# Altium schematic sheet ADC_DRIVER.SchDoc
size Tabloid; SheetNumber: 4; SheetTotal: 5
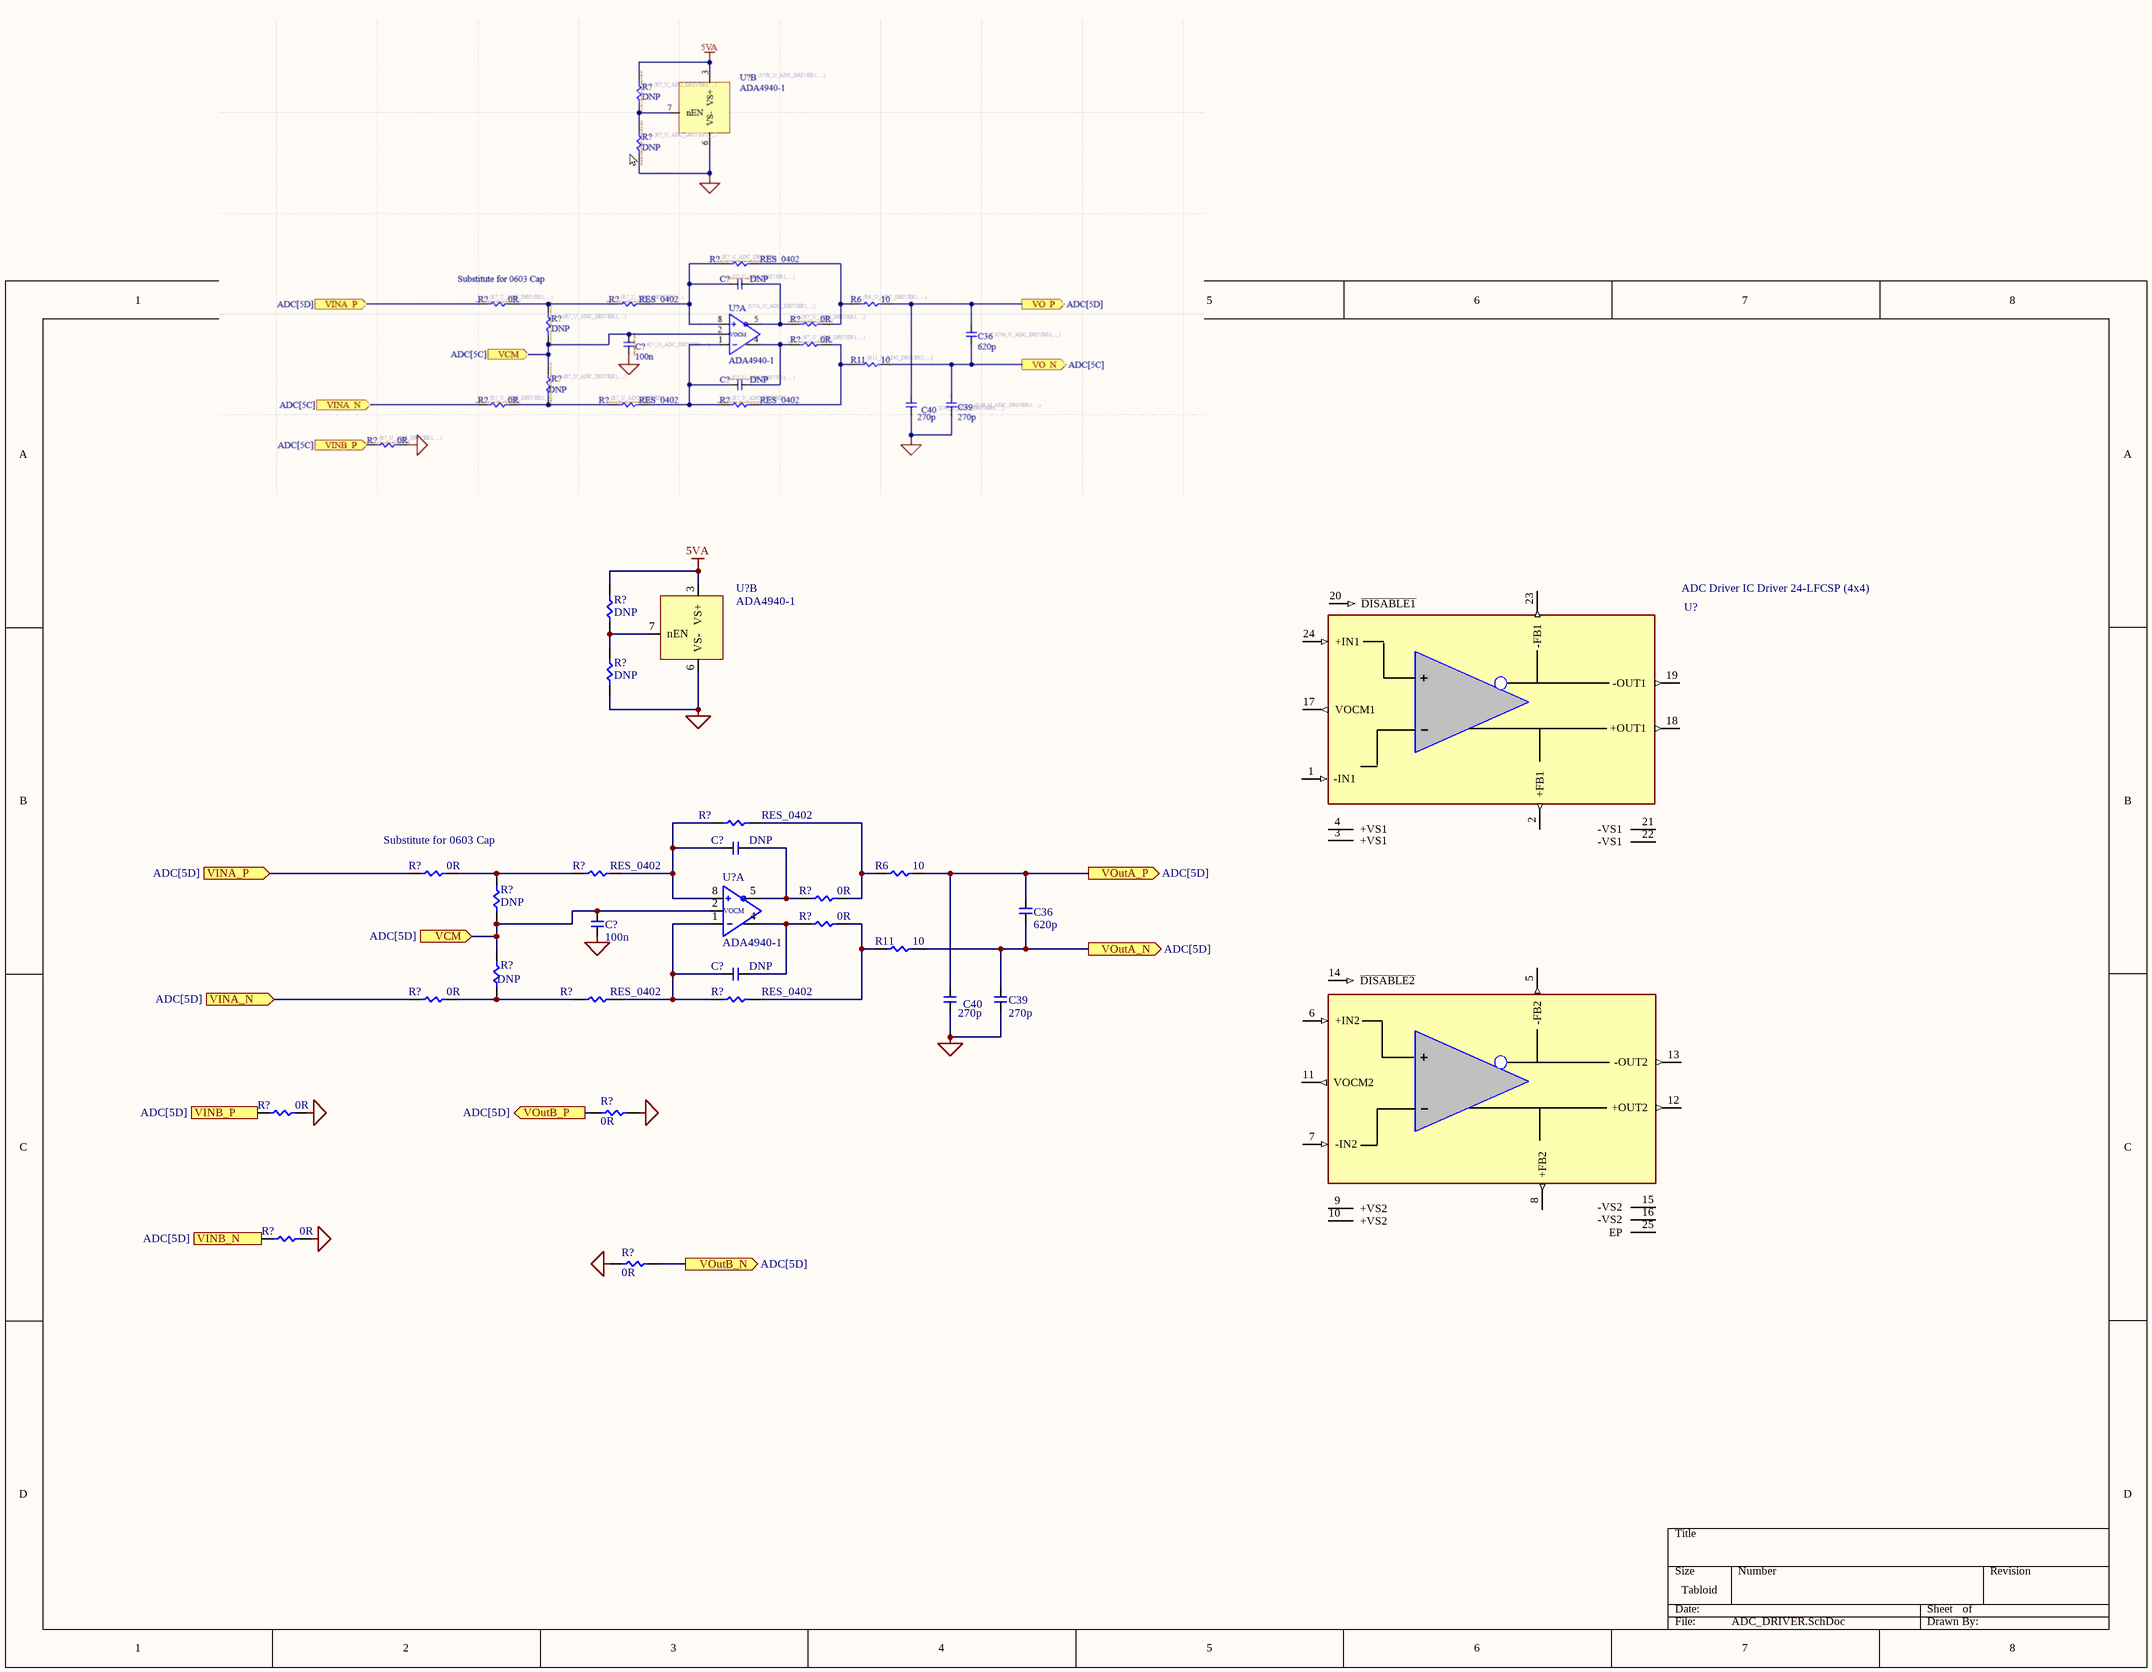
[diagram p0: ADC_DRIVER.SchDoc]

## Parts
(Parts that share a designator on the sheet are numbered #1, #2 ... from top to bottom, then left to right.)
C36  620p  [CAP_0402]
C39  270p  [CAP_0402]
C40  270p  [CAP_0402]
C?#1  DNP  [CAP_0603]  (net tie, no BOM)
C?#2  100n  [RES_0402]
C?#3  DNP  [CAP_0603]  (net tie, no BOM)
R6  10  [RES_0402]
R11  10  [RES_0402]
R?#1  DNP  [RES_0402]  (net tie, no BOM)
R?#2  DNP  [RES_0402]  (net tie, no BOM)
R?#3  RES_0402  [RES_0402]
R?#4  0R  [RES_0402]
R?#5  RES_0402  [RES_0402]
R?#6  DNP  [RES_0402]  (net tie, no BOM)
R?#7  0R  [RES_0402]
R?#8  0R  [RES_0402]
R?#9  DNP  [RES_0402]  (net tie, no BOM)
R?#10  0R  [RES_0402]
R?#11  RES_0402  [RES_0402]
R?#12  RES_0402  [RES_0402]
R?#13  0R  [RES_0402]
R?#14  0R  [RES_0402]
R?#15  0R  [RES_0402]
R?#16  0R  [RES_0402]
U?#1  ADA4940-1  [AD4940-1]  (part B of 2)
U?#2  ADC Driver IC Driver 24-LFCSP (4x4)  [QFN50P400X400X80-25N]
U?#3  ADA4940-1  [AD4940-1]  (part A of 2)

## Ports
VCM (in, see ADC[5D]), VINA_N (in, see ADC[5D]), VINA_P (in, see ADC[5D]), VINB_N (in, see ADC[5D]), VINB_P (in, see ADC[5D]), VOutA_N (out, see ADC[5D]), VOutA_P (out, see ADC[5D]), VOutB_N (out, see ADC[5D]), VOutB_P (out, see ADC[5D])

## Nets
5VA: R?#1.1 U?#1.3(VS+)
GND: C39.1 C40.1 C?#2.1 R?#2.0 R?#13.1 R?#14.1 R?#15.1 R?#16.1 U?#1.6(VS-)
VCM: C?#2.2 R?#6.0 R?#9.1 U?#3.2(VCOM) ; port VCM
VINA_N: R?#10.0 ; port VINA_N
VINA_P: R?#4.0 ; port VINA_P
VINB_N: R?#15.0 ; port VINB_N
VINB_P: R?#13.0 ; port VINB_P
VOutA_N: C36.1 C39.2 R11.1 ; port VOutA_N
VOutA_P: C36.2 C40.2 R6.1 ; port VOutA_P
VOutB_N: R?#16.0 ; port VOutB_N
VOutB_P: R?#14.0 ; port VOutB_P
NetC?#1_1: C?#1.1 R?#3.0 R?#5.1 U?#3.8(IN+)
NetC?#1_2: C?#1.2 R?#7.0 U?#3.5(OUT-)
NetC?#3_1: C?#3.1 R?#11.1 R?#12.0 U?#3.1(IN-)
NetC?#3_2: C?#3.2 R?#8.0 U?#3.4(OUT+)
NetR6_0: R6.0 R?#3.1 R?#7.1
NetR11_0: R11.0 R?#8.1 R?#12.1
NetR?#1_0: R?#1.0 R?#2.1 U?#1.7(nEN)
NetR?#4_1: R?#4.1 R?#5.0 R?#6.1
NetR?#9_0: R?#9.0 R?#10.1 R?#11.0

Not connected (* = marked no-connect by the designer): U?#2 1(-IN1) 2(+FB1) 3(+VS1) 4(+VS1) 5(-FB2) 6(+IN2) 7(-IN2) 8(+FB2) 9(+VS2) 10(+VS2) 11(VOCM2) 12(+OUT2) 13(-OUT2) 14(~{DISABLE2}) 15(-VS2) 16(-VS2) 17(VOCM1) 18(+OUT1) 19(-OUT1) 20(~{DISABLE1}) 21(-VS1) 22(-VS1) 23(-FB1) 24(+IN1) 25(EP)

## Notes on the sheet
- (near R?#4) Substitute for 0603 Cap
- (in symbol ADA4940-1, part A) VOCM

## Library data of the parts
C36 C39 C40 = 0.1u: CAP CER 0.1uF 6V X7R 0402 10%
C?#1 C?#3 = CAP_0603: CAP SMD 0603; Tolerance: *; Voltage Rating: *; Manufacturer: *; Part Number: *
C?#2 = CAP_0402: CAP SMD 0402; Tolerance: *; Voltage Rating: *; Manufacturer: *; Part Number: *
R6 R11 R?#1-R?#16 = RES_0402: RES SMD 0402; Manufacturer: *; Part Number: *; Power Rating: *
U?#1 U?#3 = ADA4940-1: Low Power, Low Distortion Fully Differential ADC Driver, GBW 260 MHz, 7V
U?#2 = ADA4940-2ACPZ-R7: IC OPAMP DIFF 2 CIRCUIT 24LFCSP; Manufacturer: Analog Devices; Vendor: Digikey; Vendor PN: 505-ADA4940-2ACPZ-R7TR-ND; SnapEDA_Link: https://www.snapeda.com/parts/ADA4940-2ACPZ-R7/Analog+Devices/view-part/?ref=snap; Package: LFCSP -24 Analog Devices; Value: *; Manufacturer PN: ADA4940-2ACPZ-R7; Check_prices: https://www.snapeda.com/parts/ADA4940-2ACPZ-R7/Analog+Devices/view-part/?ref=eda